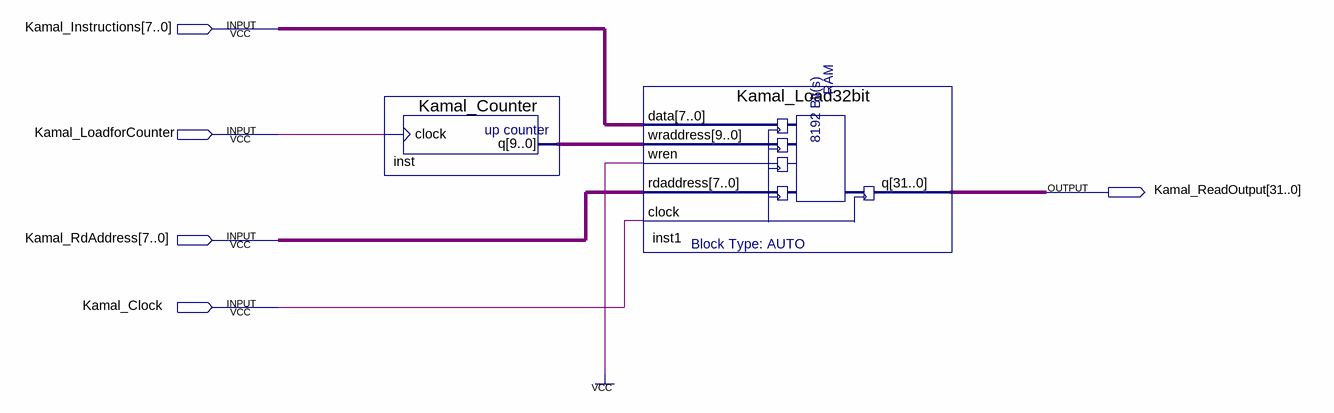
[diagram p0: schematic sheet]
// Quartus schematic Kamal_InstructionMemory.bdf as structural Verilog: 2 symbols, 5 pins
module Kamal_InstructionMemory (
  input  [7:0] Kamal_Instructions,
  input  Kamal_LoadforCounter,
  input  [7:0] Kamal_RdAddress,
  input  Kamal_Clock,
  output [31:0] Kamal_ReadOutput
);

  wire [9:0] inst_q;

  Kamal_Counter inst (.clock(Kamal_LoadforCounter), .q(inst_q));
  Kamal_Load32bit inst1 (
    .data(Kamal_Instructions), .wraddress(inst_q), .wren(1'b1), .rdaddress(Kamal_RdAddress),
    .clock(Kamal_Clock), .q(Kamal_ReadOutput));
endmodule
